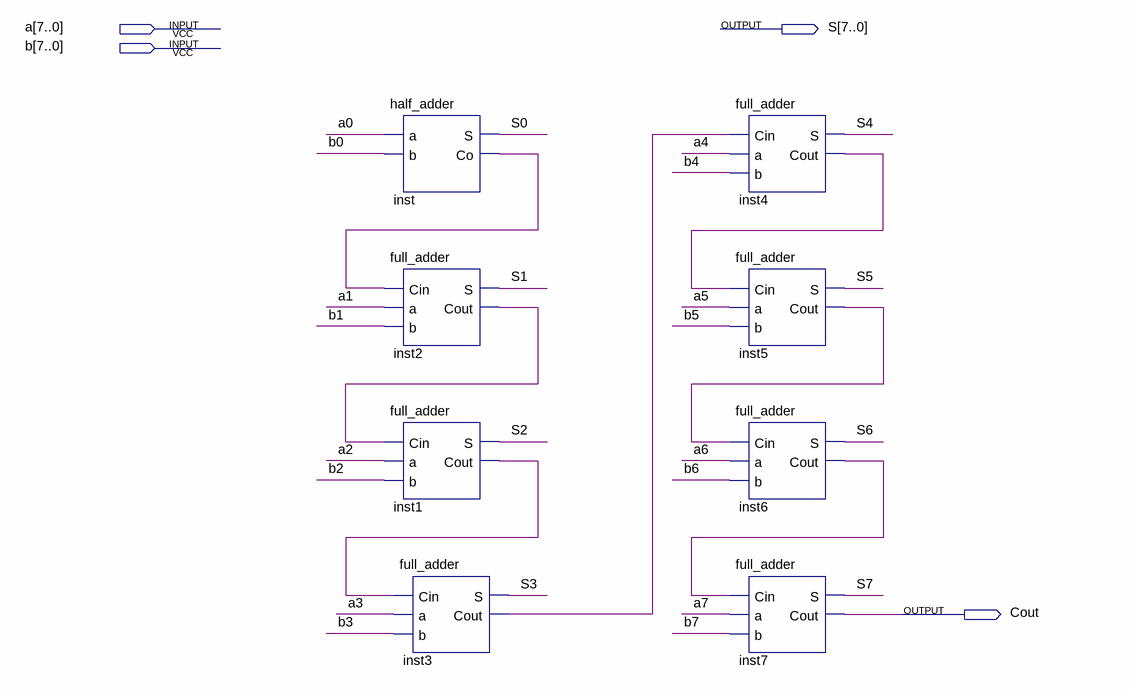
[diagram p0: schematic sheet]
// Quartus schematic adder_8bits.bdf as structural Verilog: 8 symbols, 4 pins
module adder_8bits (
  input  [7:0] a,
  input  [7:0] b,
  output [7:0] S,
  output Cout
);

  wire inst1_cout, inst2_cout, inst3_cout, inst4_cout, inst5_cout, inst6_cout, inst_co;

  half_adder inst (.a(a[0]), .b(b[0]), .S(S[0]), .Co(inst_co));
  full_adder inst2 (.Cin(inst_co), .a(a[1]), .b(b[1]), .S(S[1]), .Cout(inst2_cout));
  full_adder inst1 (.Cin(inst2_cout), .a(a[2]), .b(b[2]), .S(S[2]), .Cout(inst1_cout));
  full_adder inst3 (.Cin(inst1_cout), .a(a[3]), .b(b[3]), .S(S[3]), .Cout(inst3_cout));
  full_adder inst4 (.Cin(inst3_cout), .a(a[4]), .b(b[4]), .S(S[4]), .Cout(inst4_cout));
  full_adder inst5 (.Cin(inst4_cout), .a(a[5]), .b(b[5]), .S(S[5]), .Cout(inst5_cout));
  full_adder inst6 (.Cin(inst5_cout), .a(a[6]), .b(b[6]), .S(S[6]), .Cout(inst6_cout));
  full_adder inst7 (.Cin(inst6_cout), .a(a[7]), .b(b[7]), .S(S[7]), .Cout(Cout));
endmodule
